# EAGLE design Screen v3 (EAGLE 9.3.0)
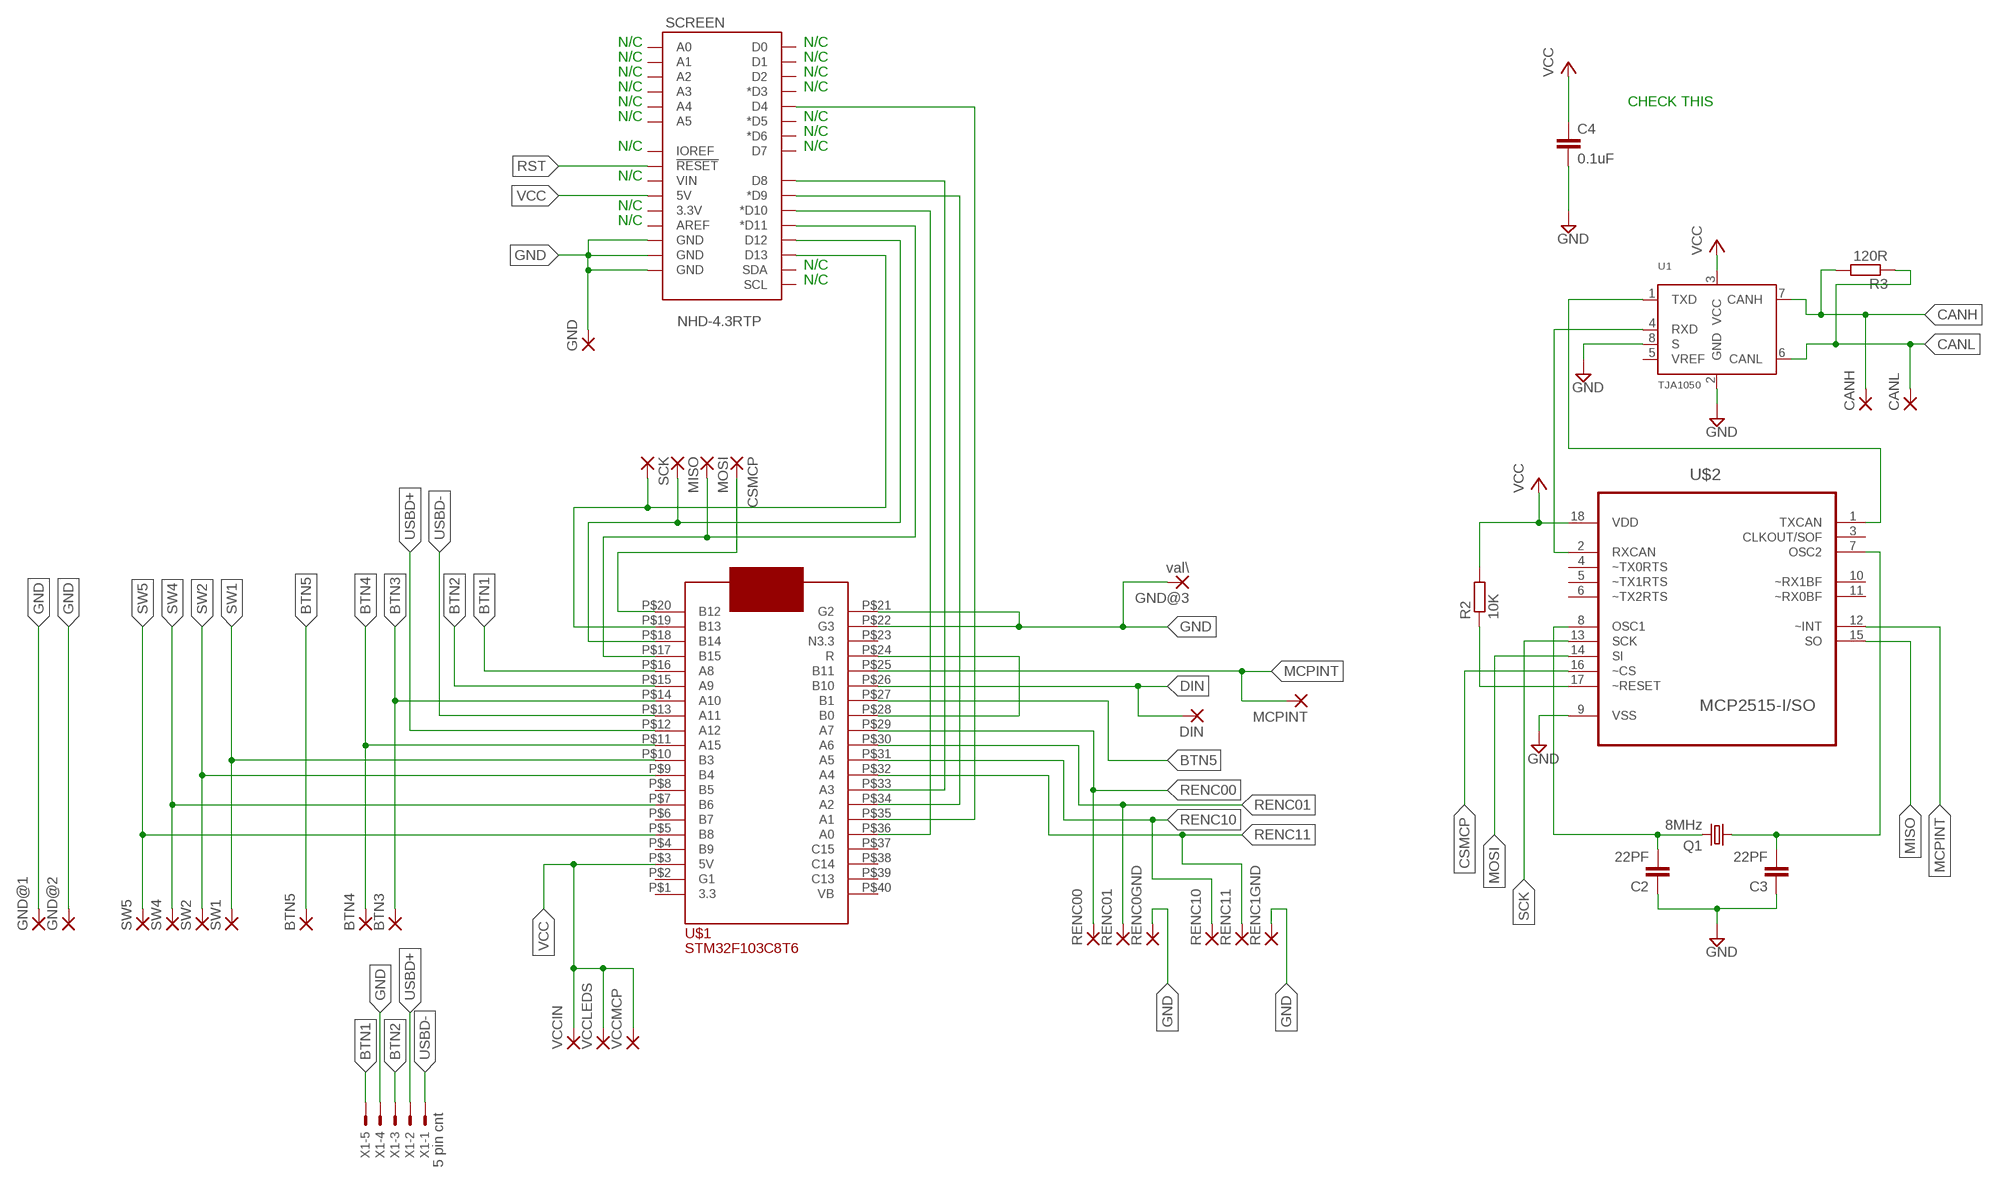
[diagram p0: schematic, sheet 1]

## Parts
BTN3  SMD5  [SMD2,54-5,08]
BTN4  SMD5  [SMD2,54-5,08]
BTN5  SMD5  [SMD2,54-5,08]
C2  22PF  C-EUC0805  [C0805]
C3  22PF  C-EUC0805  [C0805]
C4  0.1uF  C-EUC0805  [C0805]
CANH  SMD5  [SMD2,54-5,08]
CANL  SMD5  [SMD2,54-5,08]
CSMCP  SMD5  [SMD2,54-5,08]
DIN  SMD5  [SMD2,54-5,08]
GND  SMD5  [SMD2,54-5,08]
GND@1  SMD5  [SMD2,54-5,08]
GND@2  SMD5  [SMD2,54-5,08]
GND@3  val\  SMD5  [SMD2,54-5,08]
MCPINT  SMD5  [SMD2,54-5,08]
MISO  SMD5  [SMD2,54-5,08]
MOSI  SMD5  [SMD2,54-5,08]
Q1  8MHz  CRYSTALHC49S  [HC49/S]
R2  10K  R-EU_M0805  [M0805]
R3  120R  R-EU_M0805  [M0805]
RENC00  SMD5  [SMD2,54-5,08]
RENC0GND  SMD5  [SMD2,54-5,08]
RENC01  SMD5  [SMD2,54-5,08]
RENC1GND  SMD5  [SMD2,54-5,08]
RENC10  SMD5  [SMD2,54-5,08]
RENC11  SMD5  [SMD2,54-5,08]
SCK  SMD5  [SMD2,54-5,08]
SCREEN  NHD-4.3RTP  [NHD-4.3RTP]
SW1  SMD5  [SMD2,54-5,08]
SW2  SMD5  [SMD2,54-5,08]
SW4  SMD5  [SMD2,54-5,08]
SW5  SMD5  [SMD2,54-5,08]
U1  TJA1050  [SOT96-1]
U$1  STM32F103C8T6DIP40  [STM32]
U$2  MCP2515-I/SO  [SOIC127P1034X264-18N]
VCCIN  SMD5  [SMD2,54-5,08]
VCCLEDS  SMD5  [SMD2,54-5,08]
VCCMCP  SMD5  [SMD2,54-5,08]
X1  5 pin cnt  JST-XH-05-PIN-ROUND-PAD  [JST-XH-05-PACKAGE-ROUND-PAD]

## Nets
BTN1: U$1.P$16(A8) X1.5
BTN2: U$1.P$15(A9) X1.3
BTN3: BTN3.1(P) U$1.P$14(A10)
BTN4: BTN4.1(P) U$1.P$11(A15)
BTN5: BTN5.1(P) U$1.P$27(B1)
CANH: CANH.1(P) R3.2 U1.7(CANH)
CANL: CANL.1(P) R3.1 U1.6(CANL)
CS_SCREEN: SCREEN.D10(*D10) U$1.P$36(A0)
CSMCP: CSMCP.1(P) U$1.P$20(B12) U$2.16(~CS)
DIN: DIN.1(P) U$1.P$26(B10)
GND: C2.1 C3.1 C4.2 GND.1(P) GND@1.1(P) GND@2.1(P) GND@3.1(P) RENC0GND.1(P) RENC1GND.1(P) SCREEN.GND@1(GND) SCREEN.GND@2(GND) SCREEN.GND@3(GND) U1.2(GND) U1.8(S) U$1.P$21(G2) U$1.P$22(G3) U$2.9(VSS) X1.4
MCPINT: MCPINT.1(P) U$1.P$25(B11) U$2.12(~INT)
MISO: MISO.1(P) SCREEN.D12 U$1.P$18(B14) U$2.15(SO)
MOSI: MOSI.1(P) SCREEN.D11(*D11) U$1.P$17(B15) U$2.14(SI)
N$1: SCREEN.D4 U$1.P$35(A1)
N$2: SCREEN.D9(*D9) U$1.P$34(A2)
N$3: SCREEN.D8 U$1.P$33(A3)
N$4: R2.1 U$2.17(~RESET)
N$5: U1.1(TXD) U$2.1(TXCAN)
N$6: U1.4(RXD) U$2.2(RXCAN)
N$12: C2.2 Q1.2 U$2.8(OSC1)
N$13: U$1.P$24(R) U$1.P$28(B0)
N$14: C3.2 Q1.1 U$2.7(OSC2)
RENC00: RENC00.1(P) U$1.P$29(A7)
RENC01: RENC01.1(P) U$1.P$30(A6)
RENC10: RENC10.1(P) U$1.P$31(A5)
RENC11: RENC11.1(P) U$1.P$32(A4)
RST: SCREEN.RESET@1(!RESET!)
SCK: SCK.1(P) SCREEN.D13 U$1.P$19(B13) U$2.13(SCK)
SW1: SW1.1(P) U$1.P$10(B3)
SW2: SW2.1(P) U$1.P$9(B4)
SW4: SW4.1(P) U$1.P$7(B6)
SW5: SW5.1(P) U$1.P$5(B8)
USBD+: U$1.P$12(A12) X1.2
USBD-: U$1.P$13(A11) X1.1
VCC: C4.1 R2.2 SCREEN.5V U1.3(VCC) U$1.P$3(5V) U$2.18(VDD) VCCIN.1(P) VCCLEDS.1(P) VCCMCP.1(P)
Unconnected: SCREEN.3.3V SCREEN.A0 SCREEN.A1 SCREEN.A2 SCREEN.A3 SCREEN.A4 SCREEN.A5 SCREEN.AREF SCREEN.D0 SCREEN.D1 SCREEN.D2 SCREEN.D3(*D3) SCREEN.D5(*D5) SCREEN.D6(*D6) SCREEN.D7 SCREEN.IOREF SCREEN.SCL SCREEN.SDA SCREEN.VIN U1.5(VREF) U$1.P$1(3.3) U$1.P$2(G1) U$1.P$4(B9) U$1.P$6(B7) U$1.P$8(B5) U$1.P$23(N3.3) U$1.P$37(C15) U$1.P$38(C14) U$1.P$39(C13) U$1.P$40(VB) U$2.3(CLKOUT/SOF) U$2.4(~TX0RTS) U$2.5(~TX1RTS) U$2.6(~TX2RTS) U$2.10(~RX1BF) U$2.11(~RX0BF)

## Notes on the sheet
- N/C | N/C
- N/C | N/C
- N/C | N/C
- N/C | N/C
- N/C | CHECK THIS
- N/C | N/C
- N/C
- N/C | N/C
- N/C
- N/C
- N/C
- N/C
- N/C

## Library data of the parts
BTN3-BTN5 CANH CANL CSMCP DIN GND GND@1-GND@3 MCPINT MISO MOSI RENC00 RENC0GND RENC01 RENC1GND RENC10 RENC11 SCK SW1 SW2 SW4 SW5 VCCIN VCCLEDS VCCMCP = wirepad:SMD5: SMD PAD
C2-C4 = rcl:C-EU: CAPACITOR, European symbol; SPICEPREFIX: C
Q1 = crystal:CRYSTAL: CRYSTAL; OC_FARNELL: 1667008; OC_NEWARK: unknown
R2 R3 = rcl:R-EU_: RESISTOR, European symbol; SPICEPREFIX: R
SCREEN = Components:NHD-4.3RTP: Arduino R3 Footprint with SPI header Arduino Uno R3 Compatible Footprint. Matches PCB size of the original board. SparkFun Products: SAMD21 Dev Breakout <https://www.sparkfun.com/products/13672> RedBoard <https://www.sparkfun.com/products/12757> R3 Stackable Headers <https://www.sparkfun.com/products/11417>
U1 = TJA1050:TJA1050: High speed CAN transceiver The TJA1050 is the interface between the Controller Area Network (CAN) protocol controller and the physical bus. The device provides differential transmit capability to the bus and differential receive capability to the CAN controller. The TJA1050 is the third Philips high-speed CAN transceiver after the PCA82C250 and the PCA82C251. The most important differences are: Much lower electromagnetic emission due to optimal matching of the output signals CANH and CANL Improved behaviour in case of an unpowered node No standby mode. This makes the TJA1050 eminently suitable for use in nodes that are in a power-down situation in partially powered networks. AAL Eindhoven MK; AVAILABILITY: Unavailable; MF: NXP Semiconductors; MP: TJA1050; PACKAGE: None; PRICE: None
U$1 = Components:STM32F103C8T6
U$2 = MCP2515-I_SO:MCP2515-I/SO: CAN Controller; AVAILABILITY: Unavailable; DESCRIPTION: MCP2515 Series 5.5 V 1 Mb/s Stand Alone SPI Interface CAN Controller- SOIC-18; MF: Microchip; MP: MCP2515-I/SO; PACKAGE: SOIC-18 Microchip; PRICE: None
X1 = Rembrandt Electronics - JST XH Connectors v1-0:JST-XH-05-PIN: JST XH Connector 2 Pin Wire to board connector. Pitch: 2,54 mm, (0.100") Number of pins: 5 Created by Rembrandt Electronics www.rembrandtelectronics.com

## Board
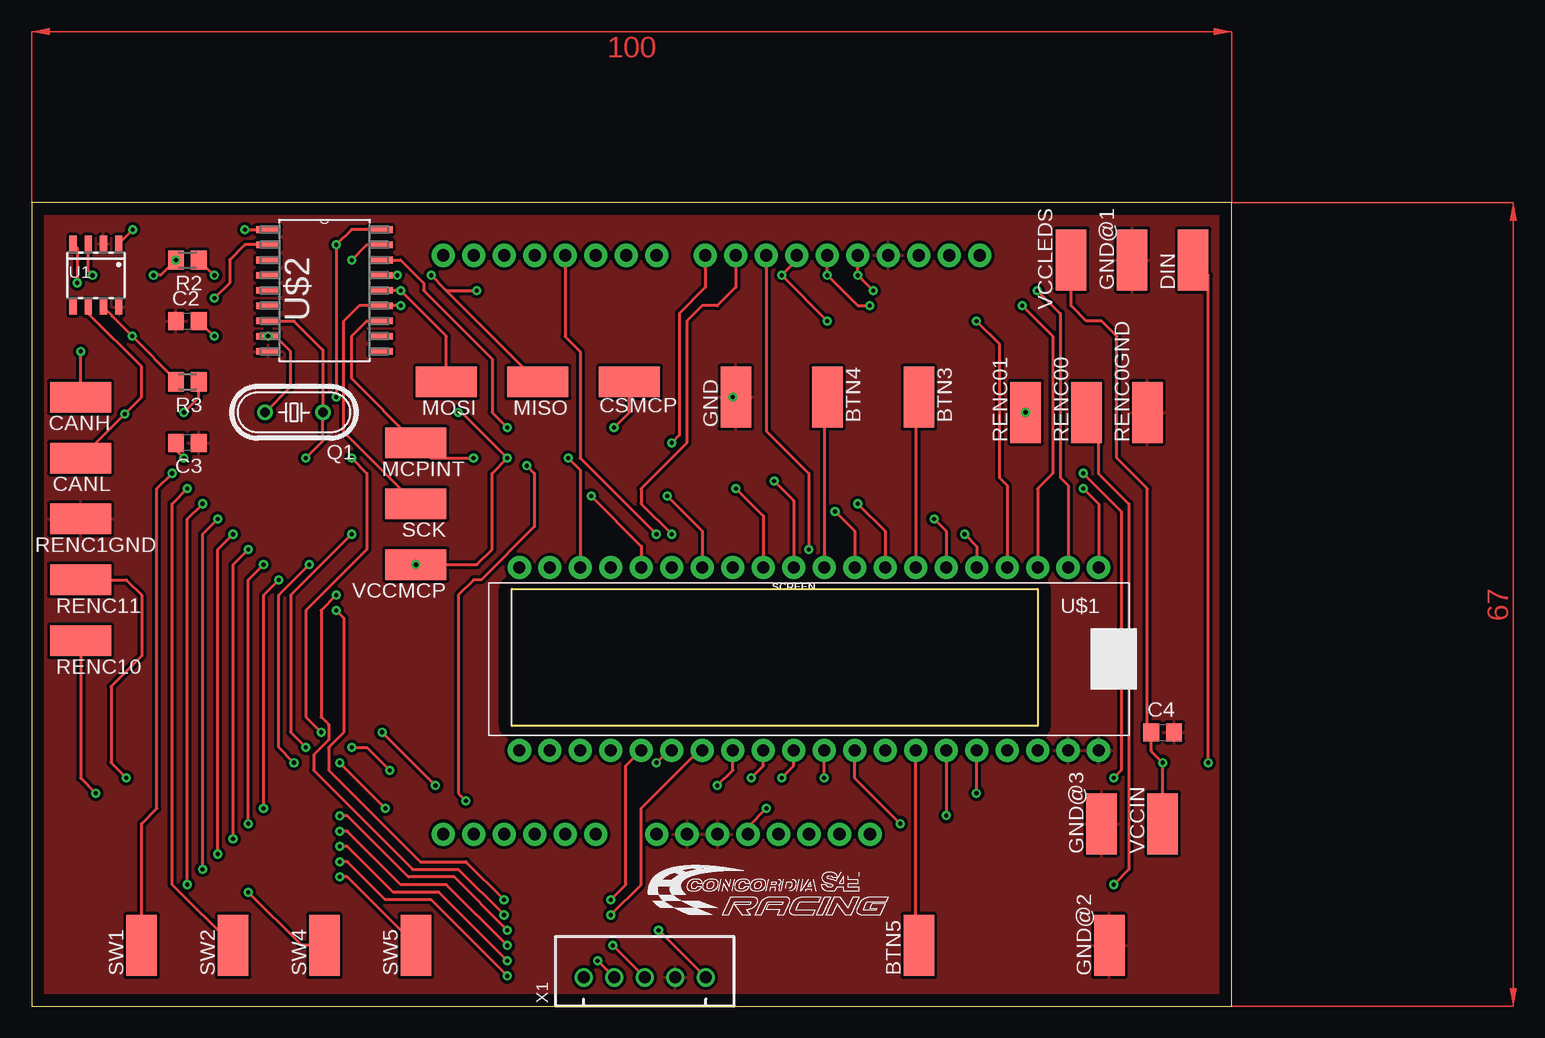
[diagram p1: board, top side]
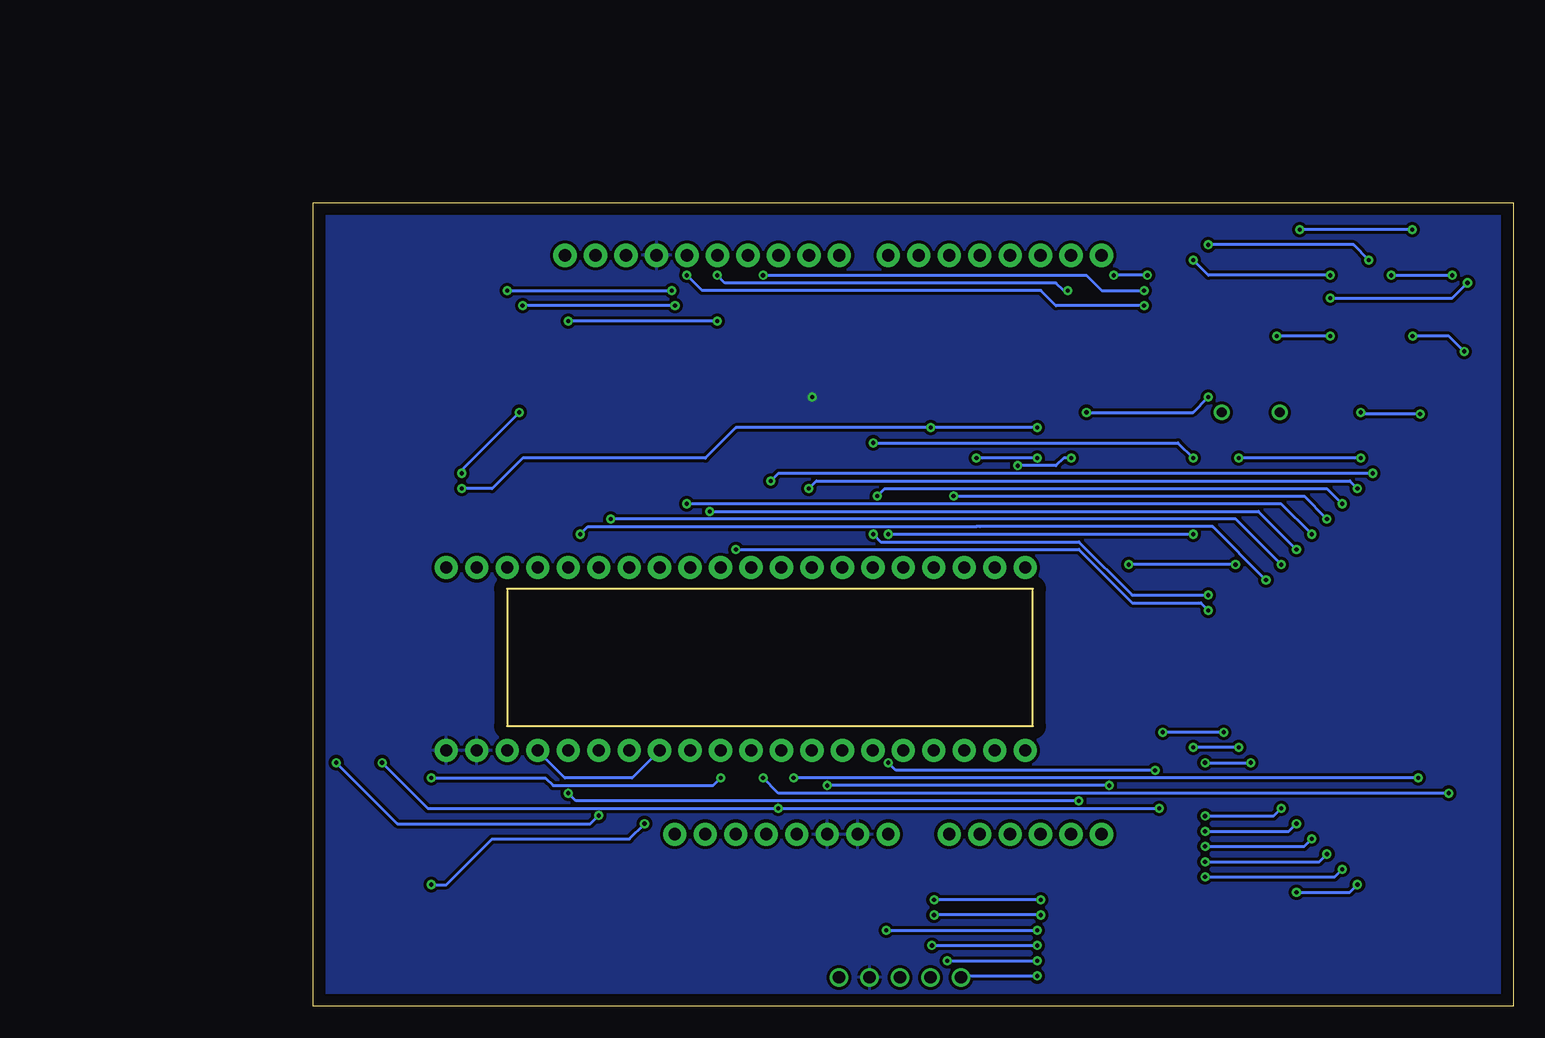
[diagram p2: board, bottom side, seen from below]

Size 100 x 67 mm. Coordinates in mm from the lower left corner, seen from the top.
Outline: 0,0 100,0 100,67 0,67 0,0
Outline: 40.02,34.81 83.83,34.81 83.83,23.38 40.02,23.38 40.02,34.81
Copper layers (1*16): Top 0.035mm / dielectric 1.5mm / Bottom 0.035mm
Design rules "jlcpcb": minimum track width 3.5mil, minimum drill 0.2mm, track to track 3.5mil, track to pad 3.5mil, pad to pad 3.5mil, via to via 3.5mil, smd to smd 0mil, copper to edge 40mil, drill to drill 6mil, minimum pad ring 10mil, minimum via ring 8mil, stop-mask expansion 4mil, vias tented up to drill 0mil, thermal gap 10mil

### Footprints (pad centres in the part's own frame; a part is rotated, then mirrored left to right if it is on the bottom)
SMD2,54-5,08 = smd 2.54 x 5.08: 1 0,0
C0805 = smd 1.3 x 1.5: 1 -0.95,0; 2 0.95,0
HC49/S = drill 0.813: 1 -2.413,0; 2 2.413,0
M0805 = smd 1.3 x 1.6: 1 -0.95,0; 2 0.95,0
NHD-4.3RTP = drill 1.016 pad 1.93: 3.3V 10.16,-24.13; 5V 7.62,-24.13; A0 -5.08,-24.13; A1 -7.62,-24.13; A2 -10.16,-24.13; A3 -12.7,-24.13; A4 -15.24,-24.13; A5 -17.78,-24.13; AREF 21.844,24.13; D0 -17.78,24.13; D1 -15.24,24.13; D2 -12.7,24.13; D3 -10.16,24.13; D4 -7.62,24.13; D5 -5.08,24.13; D6 -2.54,24.13; D7 0,24.13; D8 4.064,24.13; D9 6.604,24.13; D10 9.144,24.13; D11 11.684,24.13; D12 14.224,24.13; D13 16.764,24.13; GND@1 5.08,-24.13; GND@2 2.54,-24.13; GND@3 19.304,24.13; IOREF 15.24,-24.13; NC 17.78,-24.13; RESET@1 12.7,-24.13; SCL 26.924,24.13; SDA 24.384,24.13; VIN 0,-24.13
SOT96-1 = smd 0.6 x 1.3: 1 -1.905,-2.65; 2 -0.635,-2.65; 3 0.635,-2.65; 4 1.905,-2.65; 5 1.905,2.65; 6 0.635,2.65; 7 -0.635,2.65; 8 -1.905,2.65
STM32 = drill 1 pad 1.93: P$1 -7.62,-20.955; P$2 -7.62,-18.415; P$3 -7.62,-15.875; P$4 -7.62,-13.335; P$5 -7.62,-10.795; P$6 -7.62,-8.255; P$7 -7.62,-5.715; P$8 -7.62,-3.175; P$9 -7.62,-0.635; P$10 -7.62,1.905; P$11 -7.62,4.445; P$12 -7.62,6.985; P$13 -7.62,9.525; P$14 -7.62,12.065; P$15 -7.62,14.605; P$16 -7.62,17.145; P$17 -7.62,19.685; P$18 -7.62,22.225; P$19 -7.62,24.765; P$20 -7.62,27.305; P$21 7.62,27.305; P$22 7.62,24.765; P$23 7.62,22.225; P$24 7.62,19.685; P$25 7.62,17.145; P$26 7.62,14.605; P$27 7.62,12.065; P$28 7.62,9.525; P$29 7.62,6.985; P$30 7.62,4.445; P$31 7.62,1.905; P$32 7.62,-0.635; P$33 7.62,-3.175; P$34 7.62,-5.715; P$35 7.62,-8.255; P$36 7.62,-10.795; P$37 7.62,-13.335; P$38 7.62,-15.875; P$39 7.62,-18.415; P$40 7.62,-20.955
SOIC127P1034X264-18N = smd 1.981 x 0.559: 1 -4.699,5.08; 2 -4.699,3.81; 3 -4.699,2.54; 4 -4.699,1.27; 5 -4.699,0; 6 -4.699,-1.27; 7 -4.699,-2.54; 8 -4.699,-3.81; 9 -4.699,-5.08; 10 4.699,-5.08; 11 4.699,-3.81; 12 4.699,-2.54; 13 4.699,-1.27; 14 4.699,0; 15 4.699,1.27; 16 4.699,2.54; 17 4.699,3.81; 18 4.699,5.08
JST-XH-05-PACKAGE-ROUND-PAD = drill 1.016: 1 -5.08,0; 2 -2.54,0; 3 0,0; 4 2.54,0; 5 5.08,0

### Placement (x,y rotation side)
BTN3  73.94,50.8 180 top
BTN4  66.32,50.8 180 top
BTN5  73.94,5.08 0 top
C2  12.98,57.15 0 top
C3  12.98,46.99 180 top
C4  94.26,22.86 0 top
CANH  4.09,50.8 90 top
CANL  4.09,45.72 90 top
CSMCP  49.81,52.07 90 top
DIN  96.8,62.23 0 top
GND  58.7,50.8 0 top
GND@1  91.72,62.23 0 top
GND@2  89.81,5.08 0 top
GND@3  89.18,15.24 0 top
MCPINT  32.03,46.99 90 top
MISO  42.19,52.07 90 top
MOSI  34.57,52.07 90 top
Q1  21.87,49.53 180 top
R2  12.98,62.23 180 top
R3  12.98,52.07 180 top
RENC00  87.91,49.53 0 top
RENC0GND  92.99,49.53 0 top
RENC01  82.83,49.53 0 top
RENC1GND  4.09,40.64 90 top
RENC10  4.09,30.48 90 top
RENC11  4.09,35.56 90 top
SCK  32.03,41.91 90 top
SCREEN  52.09,38.49 0 top
SW1  9.17,5.08 0 top
SW2  16.79,5.08 0 top
SW4  24.41,5.08 0 top
SW5  32.03,5.08 0 top
U1  5.36,60.96 180 top
U$1  61.61,28.97 270 top
U$2  24.41,59.69 0 top
VCCIN  94.26,15.24 0 top
VCCLEDS  86.64,62.23 0 top
VCCMCP  32.03,36.83 90 top
X1  51.1,2.42 0 top

### Tracks (layer width: path | path; a pad name or v marks a point on that pad's centre or on a via)
BTN1  (via drill 0.35)
  Top 0.254: X1.5 v52.25,6.35 | v20.6,35.56 19.33,34.29 v19.33,16.51 | v77.75,39.37 78.75,38.36 U$1.P$16 | v39.65,6.35 35.2,10.79 31.39,10.79 26.31,15.88 v25.68,15.88
  Bottom 0.254: v20.6,35.56 25.04,40.01 44.45,40.01 44.73,40.01 77.11,40.01 v77.75,39.37 | v52.25,6.35 v39.65,6.35 | v25.68,15.88 19.96,15.88 v19.33,16.51
BTN2  (via drill 0.35)
  Top 0.254: X1.3 v48.44,5.08 | v19.33,36.83 18.06,35.56 v18.06,15.24 | v75.21,40.64 76.22,39.63 U$1.P$15 | v39.65,5.08 34.57,10.16 30.76,10.16 26.31,14.61 v25.68,14.61
  Bottom 0.254: v19.33,36.83 23.14,40.64 44.45,40.64 44.73,40.64 55.88,40.64 v75.21,40.64 | v48.44,5.08 v39.65,5.08 | v25.68,14.61 18.69,14.61 v18.06,15.24
BTN3
  Top 0.254: BTN3.1 73.67,50.54 U$1.P$14
BTN4
  Top 0.254: BTN4.1 66.06,50.54 U$1.P$11
BTN5
  Top 0.254: BTN5.1 73.67,5.34 U$1.P$27
CANH  (via drill 0.35)
  Top 0.254: U1.7 6.71,57.59 6.71,57.55 v8.38,55.88 12.03,52.24 R3.2 | CANH.1 v4.09,54.61
  Bottom 0.254: v4.09,54.61 5.36,55.88 v8.38,55.88
CANL  (via drill 0.35)
  Top 0.254: U1.6 4.72,57.78 9.17,53.34 9.17,50.8 v7.76,49.39 CANL.1 | v12.7,49.53 13.93,50.76 R3.1
  Bottom 0.254: v7.76,49.39 12.56,49.39 v12.7,49.53
CS_SCREEN  (via drill 0.35)
  Top 0.254: SCREEN.D10 61.23,47.99 64.77,44.45 v64.77,38.1 | v25.4,33.02 26.04,32.38 26.04,22.86 24.77,21.59 24.77,19.68 32.38,12.06 36.2,12.06 v39.37,8.89 | v48.26,8.89 49.53,10.16 49.53,20.06 U$1.P$36
  Bottom 0.254: v64.77,38.1 36.2,38.1 31.75,33.66 26.04,33.66 v25.4,33.02 | v39.37,8.89 v48.26,8.89
CSMCP  (via drill 0.35)
  Top 0.254: CSMCP.1 49.81,49.53 v48.54,48.26 | U$2.16 30.76,62.23 32.66,60.33 32.66,59.69 38.38,53.98 38.38,49.53 v39.65,48.26 | v87.63,43.18 88.92,41.9 U$1.P$20
  Bottom 0.254: v39.65,48.26 v48.54,48.26 64.77,48.26 67.31,45.72 82.55,45.72 85.09,43.18 v87.63,43.18
DIN  (via drill 0.35)
  Top 0.254: U$1.P$26 v76.22,15.92 | v98.07,20.32 98.07,60.96 DIN.1
  Bottom 0.254: v98.07,20.32 92.99,15.24 76.89,15.24 v76.22,15.92
GND  (via drill 0.35)
  other vias: 58.42,50.8
  pour Bottom (isolate 0.254): -11.15,76.2 -11.15,-10.16 110.77,-10.16 110.77,76.2
  pour Top (isolate 0.254): -6.07,71.12 -6.07,-5.08 105.69,-5.08 105.69,71.12
MCPINT  (via drill 0.35)
  Top 0.254: U$2.12 27.94,57.15 26.67,55.88 26.67,52.35 MCPINT.1 33.3,45.72 v36.83,45.72 | v41.27,45.09 41.91,44.45 41.91,40.01 37.47,35.56 36.83,35.56 35.56,34.29 35.56,17.78 v36.2,17.14 | v78.74,17.78 78.75,17.8 U$1.P$25
  Bottom 0.254: v36.83,45.72 37.47,45.72 38.1,45.09 v41.27,45.09 | v36.2,17.14 78.11,17.14 v78.74,17.78
MISO  (via drill 0.35)
  Top 0.254: MISO.1 34.57,59.69 | 34.57,59.69 v33.3,60.96 | 34.57,59.69 v37.11,59.69 | SCREEN.D12 66.31,60.97 v66.32,60.96 68.86,58.42 v69.85,58.42 | U$1.P$18 83.83,43.18 85.09,44.44 85.09,55.88 v82.55,58.42 | U$2.15 v30.48,60.96
  Bottom 0.254: v66.32,60.96 65.68,60.33 38.1,60.33 37.47,59.69 v37.11,59.69 | v30.48,60.96 v33.3,60.96 | v69.85,58.42 v82.55,58.42
MOSI  (via drill 0.35)
  Top 0.254: U$2.14 v30.76,59.69 34.57,55.88 MOSI.1 | SCREEN.D11 63.77,62.22 v62.51,60.96 v66.32,57.15 | U$1.P$17 81.3,43.44 80.64,44.09 80.64,55.24 v78.74,57.15
  Bottom 0.254: v30.76,59.69 34.29,59.69 35.56,60.96 v62.51,60.96 | v66.32,57.15 v78.74,57.15
N$1  (via drill 0.35)
  Top 0.254: SCREEN.D4 44.47,55.87 45.72,54.61 45.72,45.72 v52.07,39.37 | v26.67,39.37 21.59,34.29 21.59,22.86 v22.86,21.59 | v26.67,21.59 27.94,21.59 v29.84,19.68 | v52.07,20.32 53.1,21.35 U$1.P$35
  Bottom 0.254: v52.07,39.37 v26.67,39.37 | v22.86,21.59 v26.67,21.59 | v29.84,19.68 51.44,19.68 v52.07,20.32
N$2  (via drill 0.35)
  Top 0.254: SCREEN.D9 58.69,59.96 57.15,58.42 55.88,58.42 54.61,57.15 54.61,46.99 50.8,43.18 50.8,41.91 v53.34,39.37 | v25.4,34.29 24.13,33.02 24.13,24.13 24.77,23.5 24.77,22.23 23.5,20.95 23.5,19.68 31.75,11.43 35.56,11.43 v39.37,7.62 | v48.26,7.62 50.8,10.16 50.8,16.51 55.64,21.35 U$1.P$34
  Bottom 0.254: v53.34,39.37 52.7,38.73 36.2,38.73 31.75,34.29 v25.4,34.29 | v39.37,7.62 v48.26,7.62
N$3  (via drill 0.35)
  Top 0.254: SCREEN.D8 56.15,59.96 53.98,57.78 53.98,47.62 v53.34,46.99 | v26.67,45.72 27.94,44.45 27.94,38.1 22.86,33.02 22.86,24.13 v24.13,22.86 | v29.21,22.86 v33.66,18.41 | v57.15,18.41 58.44,19.7 U$1.P$33
  Bottom 0.254: v53.34,46.99 27.94,46.99 v26.67,45.72 | v24.13,22.86 v29.21,22.86 | v33.66,18.41 v57.15,18.41
N$4  (via drill 0.35)
  Top 0.254: R2.1 15.2,60.96 v15.24,60.96 | v26.67,62.23 27.94,63.5 U$2.17
  Bottom 0.254: v15.24,60.96 25.4,60.96 v26.67,62.23
N$5  (via drill 0.35)
  Top 0.254: U1.1 v8.42,64.77 | v17.78,64.77 U$2.1
  Bottom 0.254: v8.42,64.77 v17.78,64.77
N$6  (via drill 0.35)
  Top 0.254: U$2.2 17.78,63.5 16.51,62.23 16.51,60.33 v15.24,59.05 | U1.4 3.81,63.25 v3.81,60.33
  Bottom 0.254: v15.24,59.05 5.08,59.05 v3.81,60.33
N$12  (via drill 0.35)
  Top 0.254: Q1.2 21.59,51.66 21.59,54.61 20.32,55.88 U$2.8 | C2.2 15.2,55.88 v15.24,55.88
  Bottom 0.254: v15.24,55.88 U$2.8
  other vias: 19.71,55.88
N$13
  Bottom 0.254: U$1.P$28 73.43,19.05 79.02,19.05 81.3,21.33 U$1.P$24
N$14  (via drill 0.35)
  Top 0.254: U$2.7 21.87,57.15 24.28,54.74 Q1.1 24.28,47.14 v22.86,45.72 | C3.2 12.03,46.39 v12.7,45.72
  Bottom 0.254: v12.7,45.72 v22.86,45.72
RENC00  (via drill 0.35)
  Top 0.254: RENC00.1 88.9,48.54 88.9,44.45 91.44,41.91 91.44,11.43 v90.17,10.16 | v72.39,15.24 68.59,19.04 U$1.P$29
  Bottom 0.254: v90.17,10.16 88.9,10.16 85.09,13.97 73.66,13.97 v72.39,15.24
RENC01  (via drill 0.35)
  Top 0.254: v87.63,44.45 90.81,41.27 90.81,19.68 v90.17,19.05 | v66.04,19.05 66.06,19.07 U$1.P$30
  Bottom 0.254: RENC01.1 87.63,44.73 v87.63,44.45 | v90.17,19.05 80.64,19.05 80.01,18.41 66.67,18.41 v66.04,19.05
  other vias: 82.83,49.53
RENC10  (via drill 0.35)
  Top 0.254: RENC10.1 4.09,19.05 v5.36,17.78 | v62.51,19.05 63.52,20.06 U$1.P$31
  Bottom 0.254: v5.36,17.78 61.24,17.78 v62.51,19.05
RENC11  (via drill 0.35)
  Top 0.254: RENC11.1 7.9,35.56 9.17,34.29 9.17,29.21 6.63,26.67 6.63,20.32 v7.9,19.05 | v59.97,19.05 60.98,20.06 U$1.P$32
  Bottom 0.254: v7.9,19.05 v59.97,19.05
SCK  (via drill 0.35)
  Top 0.254: SCREEN.D13 v68.85,60.97 v68.86,60.96 v70.13,59.69 | U$1.P$19 86.38,43.44 85.72,44.09 85.72,57.78 v83.82,59.69 | v30.76,58.42 U$2.13 27.3,58.42 26.04,57.15 26.04,47.9 SCK.1
  Bottom 0.254: v30.76,58.42 38.1,58.42 39.37,59.69 67.59,59.69 v68.86,60.96 | v83.82,59.69 v70.13,59.69
SW1  (via drill 0.35)
  Top 0.254: SW1.1 9.17,15.24 10.44,16.51 10.44,43.18 v11.71,44.45 | v61.87,43.81 63.52,42.17 U$1.P$10
  Bottom 0.254: v11.71,44.45 61.24,44.45 v61.87,43.81
SW2  (via drill 0.35)
  Top 0.254: SW2.1 11.71,10.16 11.71,41.91 v12.98,43.18 | v58.7,43.18 60.98,40.9 U$1.P$9
  Bottom 0.254: v12.98,43.18 13.61,43.81 58.06,43.81 v58.7,43.18
SW4  (via drill 0.35)
  Top 0.254: v14.25,41.91 12.98,40.64 v12.98,10.16 | v52.98,42.55 55.9,39.63 U$1.P$7 | SW4.1 22.5,5.08 v18.06,9.53
  Bottom 0.254: v14.25,41.91 15.52,43.18 52.35,43.18 v52.98,42.55 | v18.06,9.53 13.61,9.53 v12.98,10.16
SW5  (via drill 0.35)
  Top 0.254: v15.52,40.64 14.25,39.37 v14.25,11.43 | U$1.P$5 50.81,38.36 v46.63,42.55 | SW5.1 26.31,10.79 v25.68,10.79
  Bottom 0.254: v46.63,42.55 17.42,42.55 v15.52,40.64 | v25.68,10.79 14.88,10.79 v14.25,11.43
USBD+  (via drill 0.35)
  Top 0.254: X1.2 v47.17,3.81 | v18.06,38.1 16.79,36.83 v16.79,13.97 | v66.95,41.27 68.59,39.63 U$1.P$12 | v39.65,3.81 33.93,9.53 30.12,9.53 26.31,13.34 v25.68,13.34
  Bottom 0.254: v18.06,38.1 21.23,41.27 v66.95,41.27 | v47.17,3.81 v39.65,3.81 | v25.68,13.34 17.42,13.34 v16.79,13.97
USBD-  (via drill 0.35)
  Top 0.254: v39.65,2.54 33.3,8.89 29.49,8.89 26.31,12.06 v25.68,12.06 | v16.79,39.37 15.52,38.1 v15.52,12.7 | v68.86,41.91 71.14,39.63 U$1.P$13
  Bottom 0.254: v16.79,39.37 19.33,41.91 v68.86,41.91 | X1.1 45.9,2.54 v39.65,2.54 | v25.68,12.06 16.15,12.06 v15.52,12.7
VCC  (via drill 0.35)
  Top 0.254: VCCMCP.1 37.11,36.83 38.38,38.1 38.38,44.45 v39.65,45.72 35.84,49.53 v35.56,49.53 | v44.73,45.72 45.73,44.71 U$1.P$3 | VCCIN.1 v94.26,20.32 93.31,21.27 C4.1 92.99,23.18 92.99,43.18 90.45,45.72 90.45,55.88 89.18,57.15 87.91,57.15 86.64,58.42 VCCLEDS.1 | v61.24,16.51 59.7,14.98 SCREEN.5V | v29.49,16.51 v25.68,20.32 | v21.87,20.32 20.6,21.59 20.6,34.29 v23.14,36.83 | U$2.18 26.67,64.77 v25.4,63.5 v25.4,50.8 | R2.2 10.76,60.96 v10.16,60.96 | v5.08,60.96 4.72,61.32 U1.3
  Bottom 0.254: v94.26,20.32 90.45,16.51 v61.24,16.51 v29.49,16.51 | v39.65,45.72 v44.73,45.72 | v25.68,20.32 v21.87,20.32 | v23.14,36.83 VCCMCP.1 | v35.56,49.53 26.67,49.53 v25.4,50.8 | v10.16,60.96 v5.08,60.96 | R2.2 13.3,63.5 v25.4,63.5
  other vias: 32.03,36.83 12.03,62.23
(copper drawn outside any net)
  shapes: Top area x2